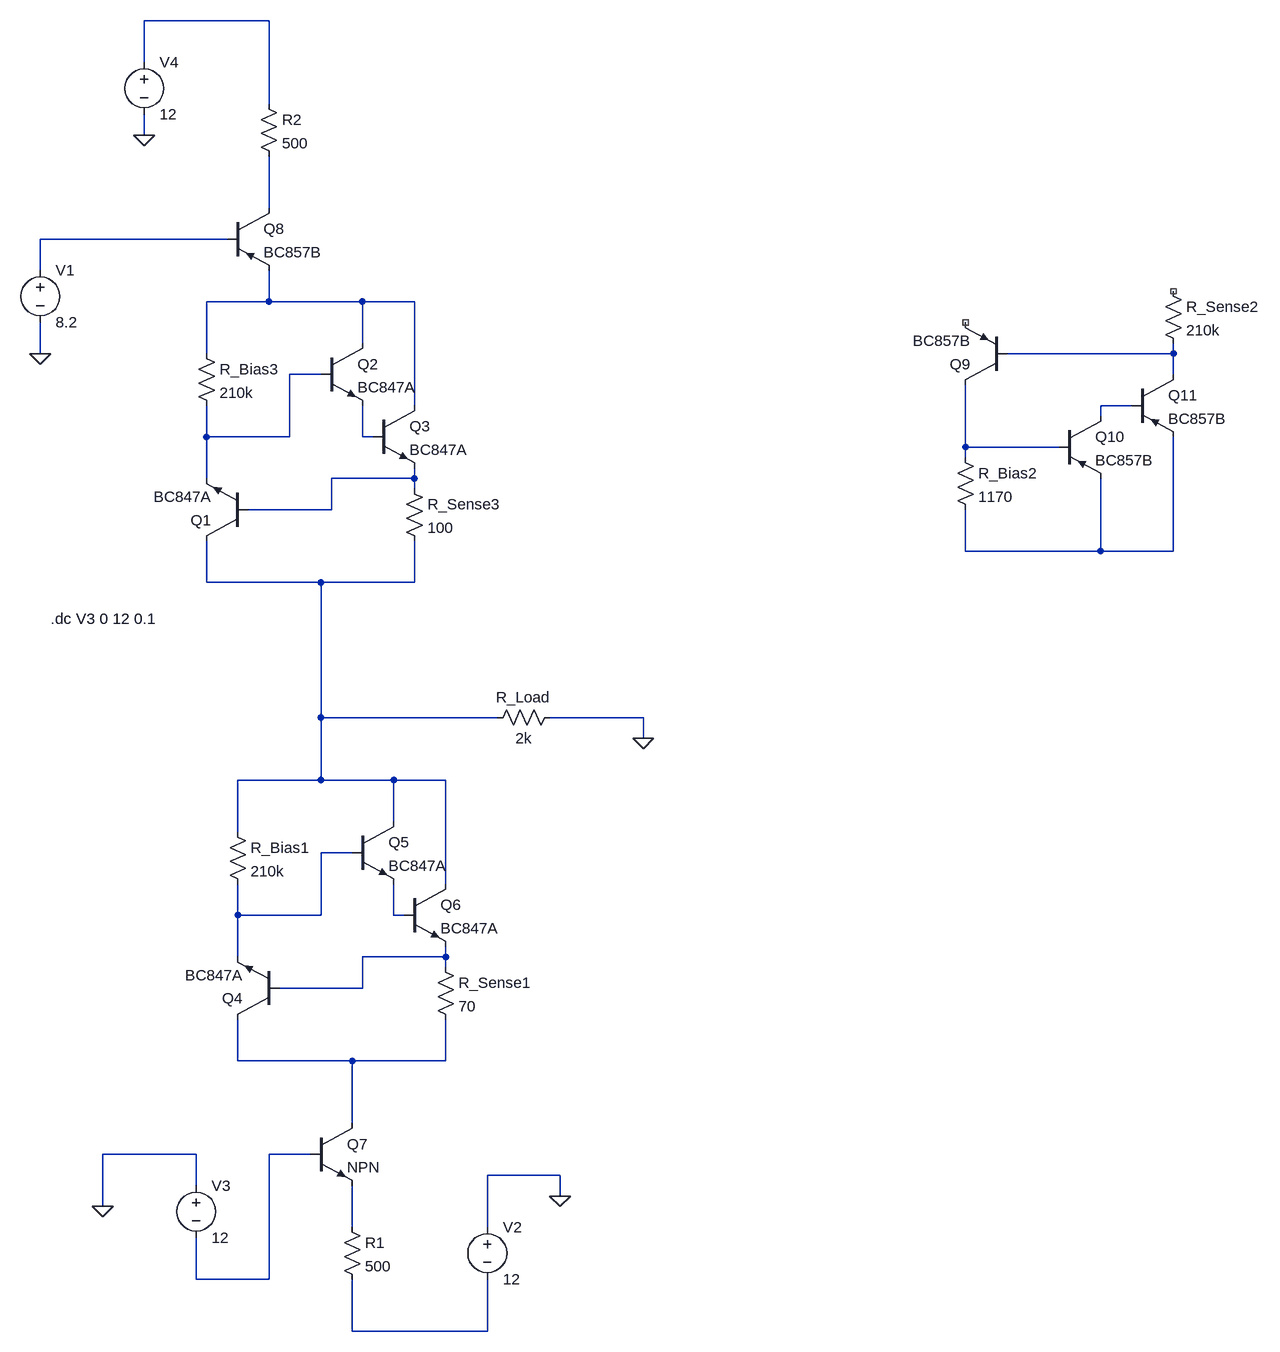
[diagram p0: schematic current_limiters.asc]
current_limiters.asc, the LTspice schematic file:
Version 4
SHEET 1 1580 1492
WIRE 48 -528 -144 -528
WIRE -144 -464 -144 -528
WIRE 48 -400 48 -528
WIRE -144 -352 -144 -384
WIRE 48 -240 48 -320
WIRE -16 -192 -304 -192
WIRE -304 -144 -304 -192
WIRE 48 -96 48 -144
WIRE 48 -96 -48 -96
WIRE 192 -96 48 -96
WIRE 272 -96 192 -96
WIRE 192 -32 192 -96
WIRE -304 -16 -304 -64
WIRE -48 -16 -48 -96
WIRE 1440 -16 1440 -32
WIRE 1440 -16 1184 -16
WIRE 128 16 80 16
WIRE 1440 16 1440 -16
WIRE 272 64 272 -96
WIRE 1376 64 1328 64
WIRE 1328 80 1328 64
WIRE -48 112 -48 64
WIRE 80 112 80 16
WIRE 80 112 -48 112
WIRE 192 112 192 64
WIRE 208 112 192 112
WIRE 1120 128 1120 32
WIRE 1264 128 1120 128
WIRE 1120 144 1120 128
WIRE -48 176 -48 112
WIRE 272 176 272 160
WIRE 272 176 144 176
WIRE 272 192 272 176
WIRE 144 224 144 176
WIRE 144 224 16 224
WIRE 1120 288 1120 224
WIRE 1328 288 1328 176
WIRE 1328 288 1120 288
WIRE 1440 288 1440 112
WIRE 1440 288 1328 288
WIRE -48 336 -48 272
WIRE 128 336 -48 336
WIRE 272 336 272 272
WIRE 272 336 128 336
WIRE 128 544 128 336
WIRE 400 544 128 544
WIRE 624 544 480 544
WIRE 624 576 624 544
WIRE 128 640 128 544
WIRE 128 640 0 640
WIRE 240 640 128 640
WIRE 320 640 240 640
WIRE 240 704 240 640
WIRE 0 720 0 640
WIRE 176 752 128 752
WIRE 320 800 320 640
WIRE 0 848 0 800
WIRE 128 848 128 752
WIRE 128 848 0 848
WIRE 240 848 240 800
WIRE 256 848 240 848
WIRE 0 912 0 848
WIRE 320 912 320 896
WIRE 320 912 192 912
WIRE 320 928 320 912
WIRE 192 960 192 912
WIRE 192 960 64 960
WIRE 0 1072 0 1008
WIRE 176 1072 0 1072
WIRE 320 1072 320 1008
WIRE 320 1072 176 1072
WIRE 176 1168 176 1072
WIRE -64 1216 -208 1216
WIRE 112 1216 48 1216
WIRE 496 1248 384 1248
WIRE -64 1264 -64 1216
WIRE 496 1280 496 1248
WIRE -208 1296 -208 1216
WIRE 176 1328 176 1264
WIRE 384 1328 384 1248
WIRE -64 1408 -64 1344
WIRE 48 1408 48 1216
WIRE 48 1408 -64 1408
WIRE 176 1488 176 1408
WIRE 384 1488 384 1408
WIRE 384 1488 176 1488
FLAG 496 1280 0
FLAG -208 1296 0
FLAG 624 576 0
FLAG -144 -352 0
FLAG -304 -16 0
SYMBOL res 304 912 R0
SYMATTR InstName R_Sense1
SYMATTR Value 70
SYMBOL res -16 704 R0
SYMATTR InstName R_Bias1
SYMATTR Value 210k
SYMBOL npn 64 1008 R180
SYMATTR InstName Q4
SYMATTR Value BC847A
SYMBOL npn 176 704 R0
SYMATTR InstName Q5
SYMATTR Value BC847A
SYMBOL npn 256 800 R0
SYMATTR InstName Q6
SYMATTR Value BC847A
SYMBOL npn 112 1168 R0
SYMATTR InstName Q7
SYMBOL res 160 1312 R0
SYMATTR InstName R1
SYMATTR Value 500
SYMBOL res 496 528 R90
WINDOW 0 0 56 VBottom 2
WINDOW 3 32 56 VTop 2
SYMATTR InstName R_Load
SYMATTR Value 2k
SYMBOL voltage 384 1312 R0
WINDOW 123 0 0 Left 0
WINDOW 39 0 0 Left 0
SYMATTR InstName V2
SYMATTR Value 12
SYMBOL voltage -64 1248 R0
WINDOW 123 0 0 Left 0
WINDOW 39 0 0 Left 0
SYMATTR InstName V3
SYMATTR Value 12
SYMBOL pnp -16 -240 R0
SYMATTR InstName Q8
SYMATTR Value BC857B
SYMBOL res 32 -416 R0
SYMATTR InstName R2
SYMATTR Value 500
SYMBOL voltage -304 -160 R0
WINDOW 123 0 0 Left 0
WINDOW 39 0 0 Left 0
SYMATTR InstName V1
SYMATTR Value 8.2
SYMBOL voltage -144 -480 R0
WINDOW 123 0 0 Left 0
WINDOW 39 0 0 Left 0
SYMATTR InstName V4
SYMATTR Value 12
SYMBOL res 1424 -128 R0
SYMATTR InstName R_Sense2
SYMATTR Value 210k
SYMBOL res 1104 128 R0
SYMATTR InstName R_Bias2
SYMATTR Value 1170
SYMBOL pnp 1184 32 R180
SYMATTR InstName Q9
SYMATTR Value BC857B
SYMBOL pnp 1264 80 R0
SYMATTR InstName Q10
SYMATTR Value BC857B
SYMBOL pnp 1376 16 R0
SYMATTR InstName Q11
SYMATTR Value BC857B
SYMBOL res 256 176 R0
SYMATTR InstName R_Sense3
SYMATTR Value 100
SYMBOL res -64 -32 R0
SYMATTR InstName R_Bias3
SYMATTR Value 210k
SYMBOL npn 16 272 R180
SYMATTR InstName Q1
SYMATTR Value BC847A
SYMBOL npn 128 -32 R0
SYMATTR InstName Q2
SYMATTR Value BC847A
SYMBOL npn 208 64 R0
SYMATTR InstName Q3
SYMATTR Value BC847A
TEXT -288 392 Left 2 !.dc V3 0 12 0.1

The netlist it stands for:
* current_limiters.asc
R_Sense1 N015 N016 70
R_Bias1 N012 N013 210k
Q4 N016 N015 N013 0 BC847A
Q5 N012 N013 N014 0 BC847A
Q6 N012 N014 N015 0 BC847A
Q7 N016 N017 N018 0 NPN
R1 N018 N019 500
R_Load 0 N012 2k
V2 0 N019 12
V3 0 N017 12
Q8 N002 N003 N004 0 BC857B
R2 N001 N002 500
V1 N003 0 8.2
V4 N001 0 12
R_Sense2 NC_01 N005 210k
R_Bias2 N009 N011 1170
Q9 N009 N005 NC_02 0 BC857B
Q10 N007 N009 N011 0 BC857B
Q11 N005 N007 N011 0 BC857B
R_Sense3 N010 N012 100
R_Bias3 N004 N006 210k
Q1 N012 N010 N006 0 BC847A
Q2 N004 N006 N008 0 BC847A
Q3 N004 N008 N010 0 BC847A
.model NPN NPN
.model PNP PNP
.lib standard.bjt
.dc V3 0 12 0.1
.backanno
.end